# EAGLE design 506_outin_raspberrypi (EAGLE 7.4.0)
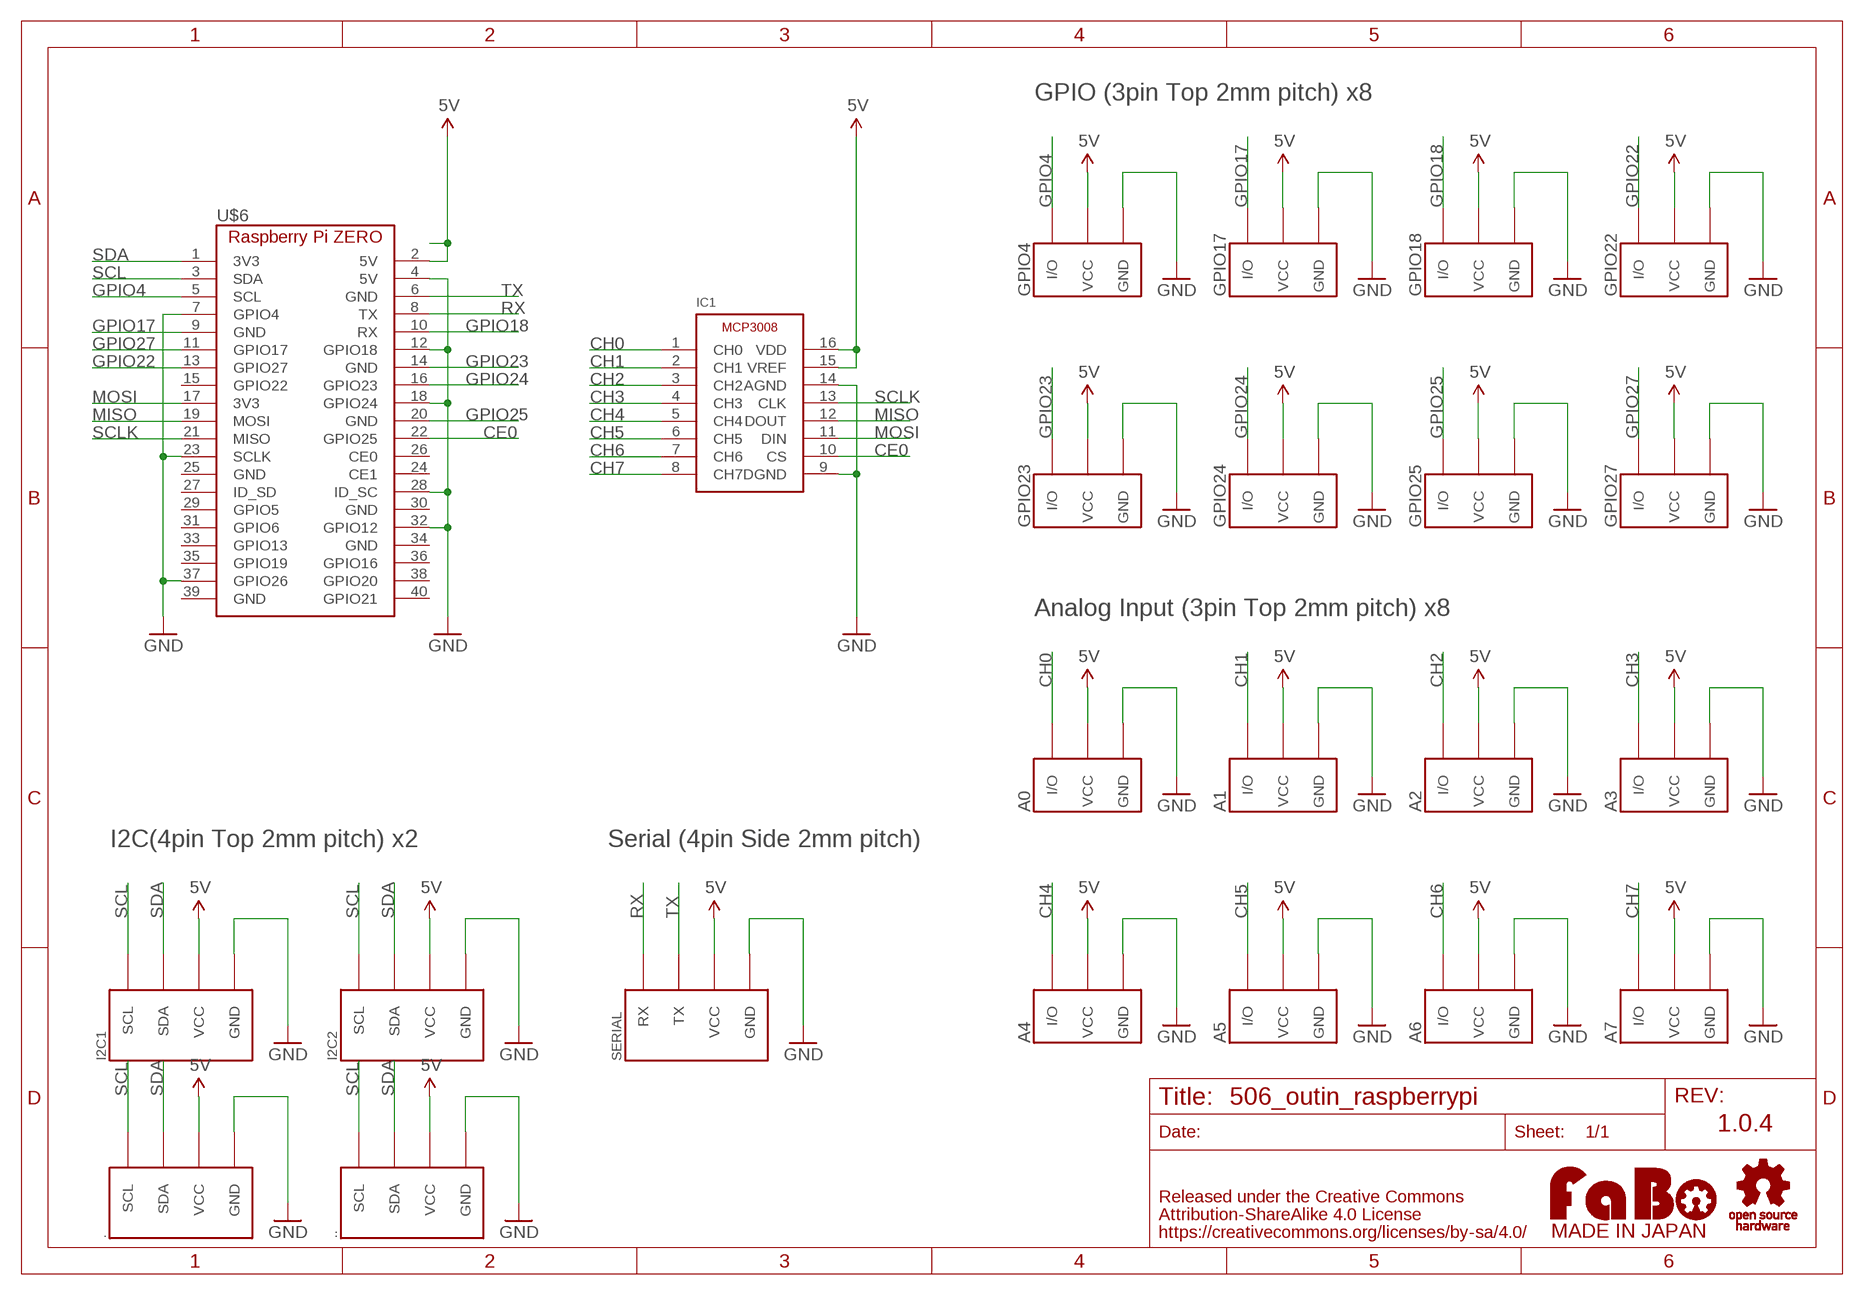
[diagram p0: schematic, sheet 1]

## Parts
.  FABO_BRICK_I2C-B04B-PASK-1  [FABO_BRICK_I2C_B04B-PASK-1]
..  FABO_BRICK_I2C-B04B-PASK-1  [FABO_BRICK_I2C_B04B-PASK-1]
A0  FABO_BRICK_3PIN-B03B-PASK-1  [FABO_BRICK_3PIN_B03B-PASK-1]
A1  FABO_BRICK_3PIN-B03B-PASK-1  [FABO_BRICK_3PIN_B03B-PASK-1]
A2  FABO_BRICK_3PIN-B03B-PASK-1  [FABO_BRICK_3PIN_B03B-PASK-1]
A3  FABO_BRICK_3PIN-B03B-PASK-1  [FABO_BRICK_3PIN_B03B-PASK-1]
A4  FABO_BRICK_3PIN-B03B-PASK-1  [FABO_BRICK_3PIN_B03B-PASK-1]
A5  FABO_BRICK_3PIN-B03B-PASK-1  [FABO_BRICK_3PIN_B03B-PASK-1]
A6  FABO_BRICK_3PIN-B03B-PASK-1  [FABO_BRICK_3PIN_B03B-PASK-1]
A7  FABO_BRICK_3PIN-B03B-PASK-1  [FABO_BRICK_3PIN_B03B-PASK-1]
GPIO4  FABO_BRICK_3PIN-B03B-PASK-1  [FABO_BRICK_3PIN_B03B-PASK-1]
GPIO17  FABO_BRICK_3PIN-B03B-PASK-1  [FABO_BRICK_3PIN_B03B-PASK-1]
GPIO18  FABO_BRICK_3PIN-B03B-PASK-1  [FABO_BRICK_3PIN_B03B-PASK-1]
GPIO22  FABO_BRICK_3PIN-B03B-PASK-1  [FABO_BRICK_3PIN_B03B-PASK-1]
GPIO23  FABO_BRICK_3PIN-B03B-PASK-1  [FABO_BRICK_3PIN_B03B-PASK-1]
GPIO24  FABO_BRICK_3PIN-B03B-PASK-1  [FABO_BRICK_3PIN_B03B-PASK-1]
GPIO25  FABO_BRICK_3PIN-B03B-PASK-1  [FABO_BRICK_3PIN_B03B-PASK-1]
GPIO27  FABO_BRICK_3PIN-B03B-PASK-1  [FABO_BRICK_3PIN_B03B-PASK-1]
I2C1  FABO_BRICK_I2C-B04B-PASK-1  [FABO_BRICK_I2C_B04B-PASK-1]
I2C2  FABO_BRICK_I2C-B04B-PASK-1  [FABO_BRICK_I2C_B04B-PASK-1]
IC1  MICROCHIP-MCP3008  [MICROCHIP-MCP3008]
SERIAL  FABO_BRICK_SERIAL-S04B-PASK-2  [FABO_BRICK_SERIAL_S04B-PASK-2]
U$4  LOGO_OSHW-T_M  [LOGO_OSHW_T_MS]
U$6  RASPBERRY_PI_ZERO  [RASPBERRY_PI_ZERO]
U$14  LOGO_FABO-M  [LOGO_FABO_MS]

## Nets
5V: ...VCC ..VCC A0.VCC A1.VCC A2.VCC A3.VCC A4.VCC A5.VCC A6.VCC A7.VCC GPIO4.VCC GPIO17.VCC GPIO18.VCC GPIO22.VCC GPIO23.VCC GPIO24.VCC GPIO25.VCC GPIO27.VCC I2C1.VCC I2C2.VCC IC1.15(VREF) IC1.16(VDD) SERIAL.VCC U$6.2(5V)
CE0: IC1.10(CS) U$6.22(GPIO25)
CH0: A0.I/O IC1.1(CH0)
CH1: A1.I/O IC1.2(CH1)
CH2: A2.I/O IC1.3(CH2)
CH3: A3.I/O IC1.4(CH3)
CH4: A4.I/O IC1.5(CH4)
CH5: A5.I/O IC1.6(CH5)
CH6: A6.I/O IC1.7(CH6)
CH7: A7.I/O IC1.8(CH7)
GND: ...GND ..GND A0.GND A1.GND A2.GND A3.GND A4.GND A5.GND A6.GND A7.GND GPIO4.GND GPIO17.GND GPIO18.GND GPIO22.GND GPIO23.GND GPIO24.GND GPIO25.GND GPIO27.GND I2C1.GND I2C2.GND IC1.9(DGND) IC1.14(AGND) SERIAL.GND U$6.4(5V) U$6.7(GPIO4) U$6.12(GPIO18) U$6.18(GPIO24) U$6.23(SCLK) U$6.28(ID_SC) U$6.32(GPIO12) U$6.37(GPIO26)
GPIO4: GPIO4.I/O U$6.5(SCL)
GPIO17: GPIO17.I/O U$6.9(GND)
GPIO18: GPIO18.I/O U$6.10(RX)
GPIO22: GPIO22.I/O U$6.13(GPIO27)
GPIO23: GPIO23.I/O U$6.14(GND)
GPIO24: GPIO24.I/O U$6.16(GPIO23)
GPIO25: GPIO25.I/O U$6.20(GND)
GPIO27: GPIO27.I/O U$6.11(GPIO17)
MISO: IC1.12(DOUT) U$6.19(MOSI)
MOSI: IC1.11(DIN) U$6.17(3V3)
RX: SERIAL.RX U$6.8(TX)
SCL: ...SCL ..SCL I2C1.SCL I2C2.SCL U$6.3(SDA)
SCLK: IC1.13(CLK) U$6.21(MISO)
SDA: ...SDA ..SDA I2C1.SDA I2C2.SDA U$6.1(3V3)
TX: SERIAL.TX U$6.6(GND)
Unconnected: U$6.15(GPIO22) U$6.24(CE1) U$6.25(GND) U$6.26(CE0) U$6.27(ID_SD) U$6.29(GPIO5) U$6.30(GND) U$6.31(GPIO6) U$6.33(GPIO13) U$6.34(GND) U$6.35(GPIO19) U$6.36(GPIO16) U$6.38(GPIO20) U$6.39(GND) U$6.40(GPIO21)

## Notes on the sheet
- GPIO (3pin Top 2mm pitch) x8
- Analog Input (3pin Top 2mm pitch) x8
- I2C(4pin Top 2mm pitch) x2 | Serial (4pin Side 2mm pitch)
- 1.0.4

## Library data of the parts
. .. I2C1 I2C2 = FaBo-Template:FABO_BRICK_I2C: FaBo Brick I2C
A0 A1-A7 GPIO4 GPIO17 GPIO18 GPIO22-GPIO25 GPIO27 = FaBo-Template:FABO_BRICK_3PIN: FaBo Brick 3pin
IC1 = FaBo-ADC:MICROCHIP-MCP3008
SERIAL = FaBo-Template:FABO_BRICK_SERIAL: FaBo Brick Serial
U$4 = FaBo-etc:LOGO_OSHW
U$6 = FaBo-Boards:RASPBERRY_PI_ZERO
U$14 = FaBo-etc:LOGO_FABO

## Board
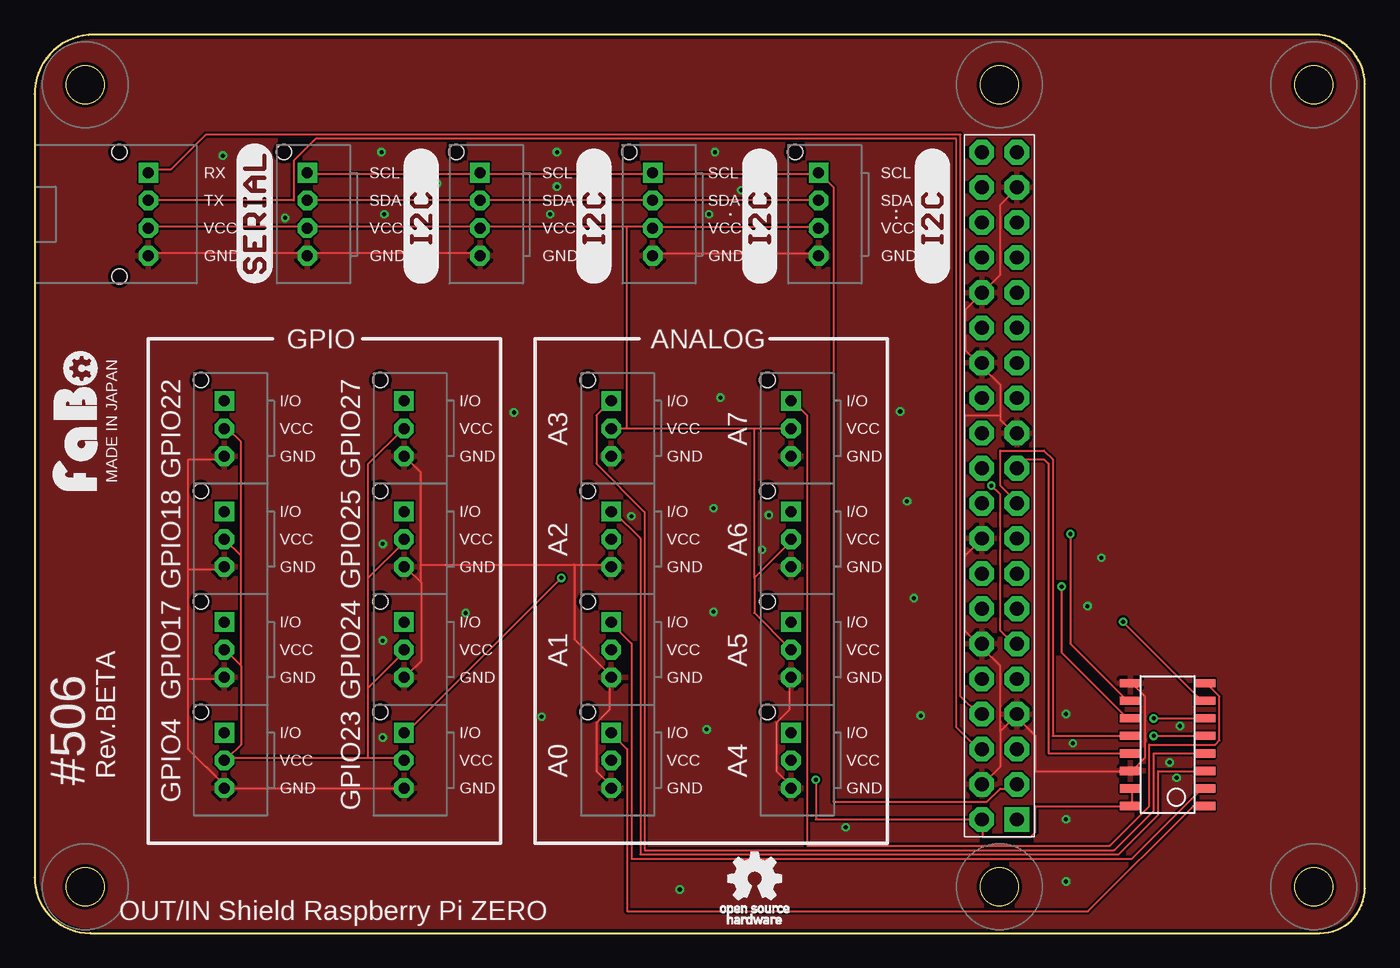
[diagram p1: board, top side]
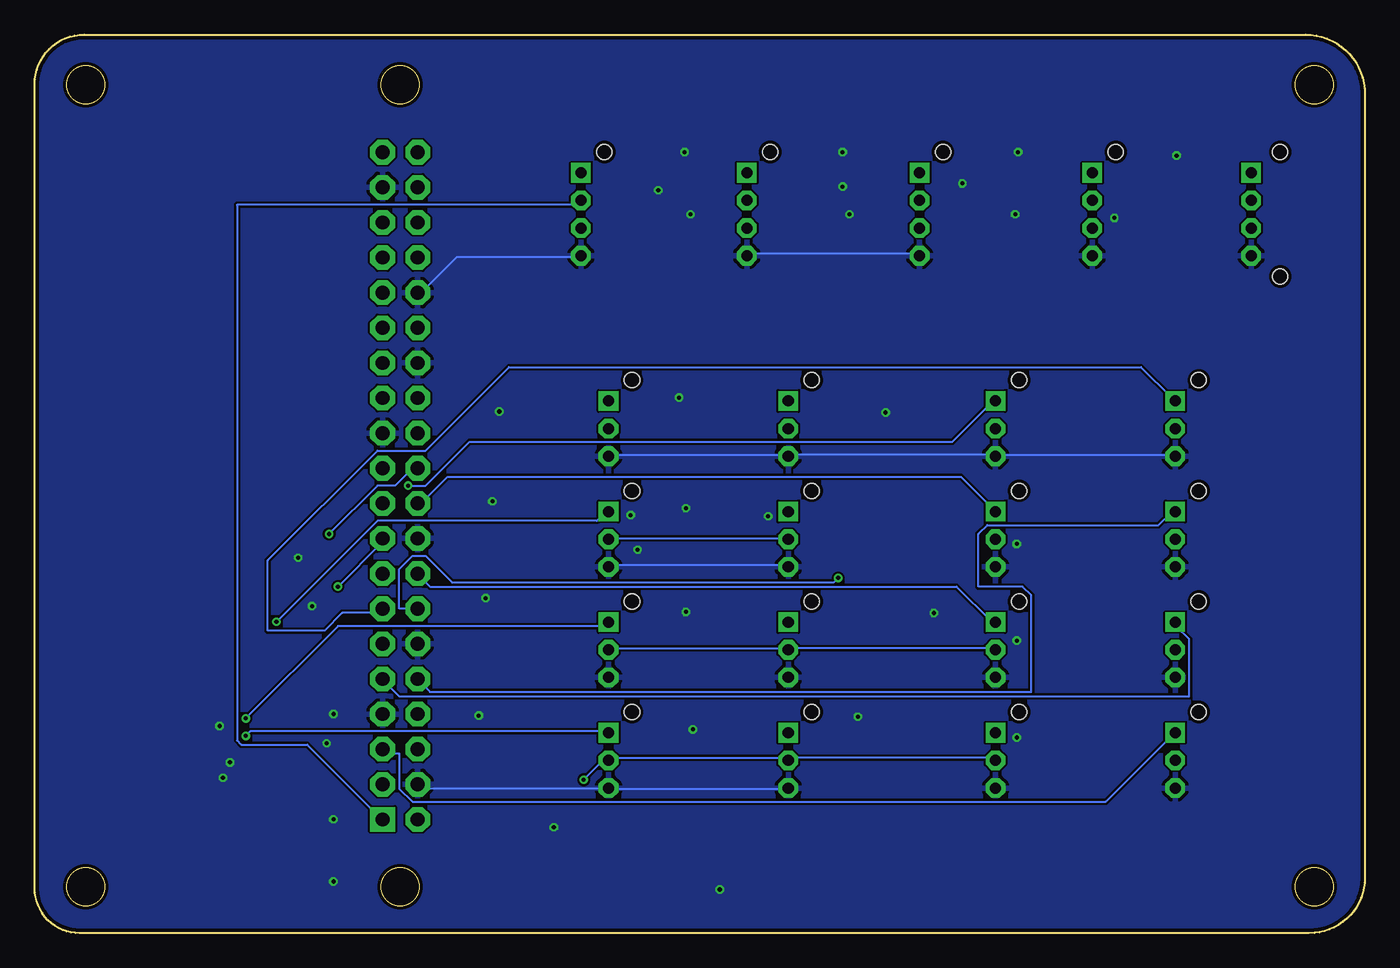
[diagram p2: board, bottom side, seen from below]

Size 96.26 x 65 mm. Coordinates in mm from the lower left corner, seen from the top.
Copper layers (1*16): Top 0.035mm / dielectric 1.5mm / Bottom 0.035mm
Design rules "Elecrow_2-layer_eagle_rule": minimum track width 6mil, minimum drill 12mil, track to track 6mil, track to pad 6mil, pad to pad 6mil, via to via 6mil, smd to smd 0mil, copper to edge 10mil, drill to drill 10mil, minimum pad ring 10mil, minimum via ring 6mil, stop-mask expansion 2mil, vias tented up to drill 100mil, thermal gap 10mil

### Footprints (pad centres in the part's own frame; a part is rotated, then mirrored left to right if it is on the bottom)
FABO_BRICK_I2C_B04B-PASK-1 = drill 0.8 pad 1.422 octagon: GND -3,0; SDA 1,0; VCC -1,0 | drill 0.8 pad 1.422 square: SCL 3,0 | hole 1.1: 4.5,1.7
FABO_BRICK_3PIN_B03B-PASK-1 = drill 0.8 pad 1.422 octagon: GND -2,0; VCC 0,0 | drill 0.8 pad 1.422 square: I/O 2,0 | hole 1.1: 3.5,1.7
MICROCHIP-MCP3008 = smd 0.6 x 1.5: 1 -4.445,-2.7; 2 -3.175,-2.7; 3 -1.905,-2.7; 4 -0.635,-2.7; 5 0.635,-2.7; 6 1.905,-2.7; 7 3.175,-2.7; 8 4.445,-2.7; 9 4.445,2.7; 10 3.175,2.7; 11 1.905,2.7; 12 0.635,2.7; 13 -0.635,2.7; 14 -1.905,2.7; 15 -3.175,2.7; 16 -4.445,2.7
FABO_BRICK_SERIAL_S04B-PASK-2 = drill 0.8 pad 1.422 octagon: GND -3,0; TX 1,0; VCC -1,0 | drill 0.8 pad 1.422 square: RX 3,0 | hole 1.1: 4.5,2.1; -4.5,2.1
RASPBERRY_PI_ZERO = drill 1 pad 1.778 square: 1 -24.27,-22.85 | drill 1 pad 1.778 octagon: 2 -24.27,-20.31; 3 -21.73,-22.85; 4 -21.73,-20.31; 5 -19.19,-22.85; 6 -19.19,-20.31; 7 -16.65,-22.85; 8 -16.65,-20.31; 9 -14.11,-22.85; 10 -14.11,-20.31; 11 -11.57,-22.85; 12 -11.57,-20.31; 13 -9.03,-22.85; 14 -9.03,-20.31; 15 -6.49,-22.85; 16 -6.49,-20.31; 17 -3.95,-22.85; 18 -3.95,-20.31; 19 -1.41,-22.85; 20 -1.41,-20.31; 21 1.13,-22.85; 22 1.13,-20.31; 23 3.67,-22.85; 24 3.67,-20.31; 25 6.21,-22.85; 26 6.21,-20.31; 27 8.75,-22.85; 28 8.75,-20.31; 29 11.29,-22.85; 30 11.29,-20.31; 31 13.83,-22.85; 32 13.83,-20.31; 33 16.37,-22.85; 34 16.37,-20.31; 35 18.91,-22.85; 36 18.91,-20.31; 37 21.45,-22.85; 38 21.45,-20.31; 39 23.99,-22.85; 40 23.99,-20.31

### Placement (x,y rotation side)
.  44.73,52 90 top
..  56.73,52 90 top
A0  41.73,12.5 90 top
A1  41.73,20.5 90 top
A2  41.73,28.5 90 top
A3  41.73,36.5 90 top
A4  54.73,12.5 90 top
A5  54.73,20.5 90 top
A6  54.73,28.5 90 top
A7  54.73,36.5 90 top
GPIO4  13.73,12.5 90 top
GPIO17  13.73,20.5 90 top
GPIO18  13.73,28.5 90 top
GPIO22  13.73,36.5 90 top
GPIO23  26.73,12.5 90 top
GPIO24  26.73,20.5 90 top
GPIO25  26.73,28.5 90 top
GPIO27  26.73,36.5 90 top
I2C1  19.73,52 90 top
I2C2  32.23,52 90 top
IC1  81.98,13.64 90 top
SERIAL  8.23,52 90 top
U$2  [LOGO_SILK_I2C]  29.23,47 90 top
U$3  [LOGO_SILK_SERIAL2]  17.23,47 90 top
U$4  52.12,3.92 0 top
U$5  [LOGO_SILK_I2C]  41.73,47 90 top
U$6  48.23,32.5 90 top
U$7  [LOGO_SILK_I2C]  53.73,47 90 top
U$8  [LOGO_SILK_I2C]  66.23,47 90 top
U$14  4.93,37.05 90 top

### Tracks (layer width: path | path; a pad name or v marks a point on that pad's centre or on a via)
5V  (via drill 0.3)
  Top 0.152: SERIAL.VCC 8.27,51.1 19.7,51.1 I2C1.VCC 20.02,51.1 32.08,51.1 I2C2.VCC 32.4,51.1 42.88,51.1 | 42.88,51.1 44.47,51.1 ..VCC 44.78,51.1 56.53,51.1 ...VCC | IC1.15 79.39,10.46 79.39,9.19 IC1.16 79.07,9.19 72.41,9.19 72.41,7.29 72.09,6.97 68.6,6.97 68.6,7.92 U$6.2 68.28,8.24 56.53,8.24 v56.53,11.1 | 52.09,36.5 54.63,36.5 A7.VCC | 52.09,36.5 42.88,36.5 | 42.88,36.5 41.93,36.5 A3.VCC | 52.09,25.7 52.09,23.16 54.63,20.62 A5.VCC | 52.09,25.7 54.63,28.24 A6.VCC | 52.09,25.7 52.09,36.5 | 13.99,12.69 14.94,13.64 14.94,19.35 | 14.94,19.35 13.99,20.3 GPIO17.VCC | 14.94,27.29 GPIO18.VCC | 14.94,19.35 14.94,27.29 | 14.94,27.29 14.94,35.55 13.99,36.5 GPIO22.VCC | 13.99,12.69 24.15,12.69 | 24.15,12.69 26.69,12.69 GPIO23.VCC | 13.99,12.69 GPIO4.VCC | 24.15,17.77 26.69,20.3 GPIO24.VCC | 24.15,12.69 24.15,17.77 | 24.15,25.7 26.69,28.24 GPIO25.VCC | 24.15,17.77 24.15,25.7 | 24.15,25.7 24.15,33.96 26.69,36.5 GPIO27.VCC | 42.88,36.5 42.88,51.1
  Bottom 0.152: v56.53,11.1 55.26,12.37 54.95,12.37 A4.VCC 54.63,12.69 41.93,12.69 A0.VCC 41.61,12.69 27,12.69 GPIO23.VCC | A5.VCC 54.63,20.62 41.93,20.62 A1.VCC 41.61,20.62 27,20.62 GPIO24.VCC | A2.VCC 41.93,28.56 54.63,28.56 A6.VCC
CE0  (via drill 0.3)
  Top 0.152: v74.95,28.88 74.95,20.94 79.07,16.81 IC1.10
  Bottom 0.152: v74.95,28.88 71.45,32.37 70.19,32.37 69.23,33.32 68.6,33.32 U$6.22
CH0
  Top 0.152: IC1.1 84.47,9.19 83.84,9.19 76.22,1.57 42.88,1.57 42.88,13.32 41.93,14.27 A0.I/O
CH1
  Top 0.152: IC1.2 84.47,10.46 79.39,5.38 43.2,5.38 43.2,20.94 41.93,22.21 A1.I/O
CH2
  Top 0.152: IC1.3 84.47,11.73 81.3,11.73 81.3,8.56 78.44,5.7 43.83,5.7 43.83,28.56 41.93,30.46 A2.I/O
CH3
  Top 0.152: IC1.4 84.47,13 80.98,13 80.98,8.88 78.12,6.02 44.15,6.02 44.15,30.46 40.66,33.96 40.66,37.45 41.61,38.4 A3.I/O
CH4  (via drill 0.3)
  Top 0.152: v80.98,14.27 84.47,14.27 IC1.5
  Bottom 0.152: v80.98,14.27 80.66,14.59 54.95,14.59 A4.I/O
CH5  (via drill 0.3)
  Top 0.152: v80.98,15.54 84.47,15.54 IC1.6
  Bottom 0.152: v80.98,15.54 74.31,22.21 54.95,22.21 A5.I/O
CH6  (via drill 0.3)
  Top 0.152: v78.76,22.53 84.47,16.81 IC1.7
  Bottom 0.152: v78.76,22.53 71.45,29.83 55.58,29.83 54.95,30.46 A6.I/O
CH7
  Top 0.152: IC1.8 84.79,18.08 85.74,17.13 85.74,13.96 85.42,13.64 80.66,13.64 80.66,9.19 77.81,6.33 55.9,6.33 55.9,37.45 54.95,38.4 A7.I/O
GND  (via drill 0.3)
  Top 0.152: 69.87,37.45 69.87,39.67 68.6,40.94 U$6.28 68.28,41.26 67.33,42.21 67.33,45.07 68.28,46.02 U$6.32 68.6,46.34 69.87,47.61 69.87,52.69 70.82,53.64 U$6.37 | 69.87,37.45 69.87,37.13 70.82,36.18 U$6.23 | SERIAL.GND 8.27,49.2 19.7,49.2 I2C1.GND 20.02,49.2 32.08,49.2 I2C2.GND | ...GND 56.53,49.2 44.78,49.2 ..GND | GPIO23.GND 26.69,10.46 13.99,10.46 GPIO4.GND 13.67,10.78 11.13,13.32 11.13,18.4 | 11.13,18.4 13.67,18.4 GPIO17.GND | 11.13,26.34 13.67,26.34 GPIO18.GND | 11.13,18.4 11.13,26.34 | 11.13,26.34 11.13,34.27 13.67,34.27 GPIO22.GND | IC1.9 79.39,18.08 80.34,17.13 80.34,12.69 79.39,11.73 IC1.14 79.07,11.73 72.41,11.73 72.41,14.27 71.14,15.54 U$6.7 70.82,15.54 69.87,14.59 | 69.87,14.59 69.87,12.05 68.6,10.78 U$6.4 | 69.87,14.59 69.87,19.35 68.6,20.62 U$6.12 68.28,20.94 67.33,21.89 67.33,27.29 | 67.33,27.29 68.28,28.24 U$6.18 | A0.GND 41.61,10.78 40.66,11.73 40.66,15.22 41.61,16.18 41.61,18.4 A1.GND 41.61,18.72 39.07,21.26 39.07,26.66 | A4.GND 54.63,10.78 53.67,11.73 53.67,15.22 54.63,16.18 54.63,18.4 A5.GND | 27.96,25.39 27.96,19.67 27,18.72 GPIO24.GND | 27.96,25.39 27,26.34 GPIO25.GND | 27.96,25.39 27.96,26.66 | 27.96,26.66 27.96,33.32 27,34.27 GPIO27.GND | 27.96,26.66 39.07,26.66 | 39.07,26.66 41.61,26.66 A2.GND | 69.87,37.45 67.33,37.45 67.33,27.29
  Bottom 0.152: I2C2.GND 32.4,49.2 44.47,49.2 ..GND | U$6.32 68.28,46.34 65.74,48.88 56.85,48.88 ...GND | A0.GND 41.93,10.46 54.63,10.46 A4.GND 54.95,10.46 68.28,10.46 U$6.4 | A7.GND 54.63,34.59 41.93,34.59 A3.GND 41.61,34.59 27,34.59 GPIO27.GND 26.69,34.59 13.99,34.59 GPIO22.GND | A2.GND 41.93,26.66 54.63,26.66 A6.GND
  other vias: 46.69,3.16 74.63,8.24 37.8,56.5 25.1,56.5 49.23,56.5 74.63,15.86 51.13,53.74 29.13,54.24 13.63,56.24 18.13,51.74 58.69,7.66 74.63,3.74 82.63,11.24 64.13,15.74 63.63,24.24 63.13,31.24 62.63,37.74 37.8,54 37.3,52 25.3,52 48.8,52 31.19,23.16 36.69,15.66 34.69,37.66 77.19,27.16 76.19,23.66 49.63,38.74 49.13,30.74 53.13,30.24 52.63,27.74 49.13,23.24 48.63,14.74 82.13,12.36 25.19,28.16 25.19,21.16 25.19,14.16 75.13,13.74 82.88,14.99 43.19,30.16
  pour Top: -0.3,-0.65 97.49,-0.65 97.49,65.39 -0.3,65.39
  pour Bottom: -0.3,-0.65 97.49,-0.65 97.49,65.39 -0.3,65.39
GPIO4
  Bottom 0.152: GPIO4.I/O 13.99,14.27 18.75,9.51 68.91,9.51 69.87,10.46 69.87,13 70.82,13 U$6.5
GPIO17
  Bottom 0.152: GPIO17.I/O 13.67,22.21 12.72,21.26 12.72,17.13 69.87,17.13 70.82,18.08 U$6.9
GPIO18
  Bottom 0.152: GPIO18.I/O 13.99,30.46 14.94,29.51 27.32,29.51 27.96,28.88 27.96,25.07 24.78,25.07 24.15,24.43 24.15,17.45 67.65,17.45 68.28,18.08 U$6.10
GPIO22
  Bottom 0.152: GPIO22.I/O 13.99,38.72 16.21,40.94 61.93,40.94 67.96,34.91 71.45,34.91 79.39,26.97 79.39,21.89 75.26,21.89 74,23.16 71.14,23.16 U$6.13
GPIO23  (via drill 0.3)
  Top 0.152: v38.12,25.7 27,14.59 GPIO23.I/O
  Bottom 0.152: v38.12,25.7 38.43,25.39 66.06,25.39 67.96,27.29 68.91,27.29 69.87,26.34 69.87,23.48 68.6,23.48 U$6.14
GPIO24
  Bottom 0.152: GPIO24.I/O 27,22.53 29.54,25.07 67.65,25.07 68.28,25.7 U$6.16
GPIO25
  Bottom 0.152: GPIO25.I/O 27,30.78 29.23,33.01 66.38,33.01 68.28,31.1 U$6.20
GPIO27  (via drill 0.3)
  Top 0.152: v69.23,32.37 69.87,31.73 69.87,21.89 70.82,20.94 U$6.11
  Bottom 0.152: v69.23,32.37 67.96,32.37 64.79,35.55 29.86,35.55 27,38.4 GPIO27.I/O
MISO
  Top 0.152: IC1.12 79.07,14.27 73.68,14.27 73.68,34.27 73.04,34.91 69.87,34.91 69.87,32.37 70.82,31.42 70.82,31.1 U$6.19
MOSI  (via drill 0.3)
  Top 0.152: v74.31,25.07 74.31,20.3 79.07,15.54 IC1.11
  Bottom 0.152: v74.31,25.07 71.14,28.24 U$6.17
RX
  Top 0.152: SERIAL.RX 8.27,55.23 9.86,55.23 12.4,57.77 67.01,57.77 67.01,17.13 68.28,15.86 U$6.8
SCL
  Top 0.152: I2C1.SCL 20.02,54.91 32.08,54.91 I2C2.SCL 32.4,54.91 44.47,54.91 ..SCL 44.78,54.91 56.53,54.91 ...SCL 56.85,54.91 57.8,53.96 57.8,9.51 68.91,9.51 69.87,10.46 70.82,10.46 U$6.3
SCLK
  Top 0.152: IC1.13 79.07,13 73.36,13 73.36,33.96 73.04,34.27 71.14,34.27 71.14,33.64 U$6.21
SDA
  Top 0.152: I2C1.SDA 20.02,53.01 32.08,53.01 I2C2.SDA 32.4,53.01 44.47,53.01 ..SDA 44.78,53.01 56.53,53.01 ...SDA
  Bottom 0.152: U$6.1 71.14,8.24 76.53,13.64 81.3,13.64 81.62,13.96 81.62,52.69 56.85,52.69 ...SDA
TX
  Top 0.152: SERIAL.TX 8.27,53.01 18.75,53.01 18.75,55.87 20.34,57.45 66.69,57.45 66.69,14.91 68.28,13.32 U$6.6

### Text on the board
tPlace: RX | SCL | SCL | SCL | SCL | TX | SDA | SDA | SDA | SDA | VCC | VCC | VCC | VCC | VCC | GND | GND | GND | GND | GND | GPIO | ANALOG | I/O | I/O | I/O | I/O | MADE IN JAPAN | VCC | VCC | VCC | VCC | GND | GND | GND | GND | I/O | I/O | I/O | I/O | VCC | VCC | VCC | VCC | GND | GND | GND | GND | I/O | I/O | I/O | I/O | VCC | VCC | VCC | VCC | GND | GND | GND | GND | I/O | I/O | I/O | I/O | VCC | VCC | VCC | VCC | #506 | Rev.BETA | GND | GND | GND | GND | OUT/IN Shield Raspberry Pi ZERO